# Altium schematic sheet Sheet3.SchDoc
size A3; Author: Van Hieu; Organization: BACH-KHOA-DK; SheetNumber: 2; SheetTotal: 6; Gmail: maivanhieu24042003@gmail.com
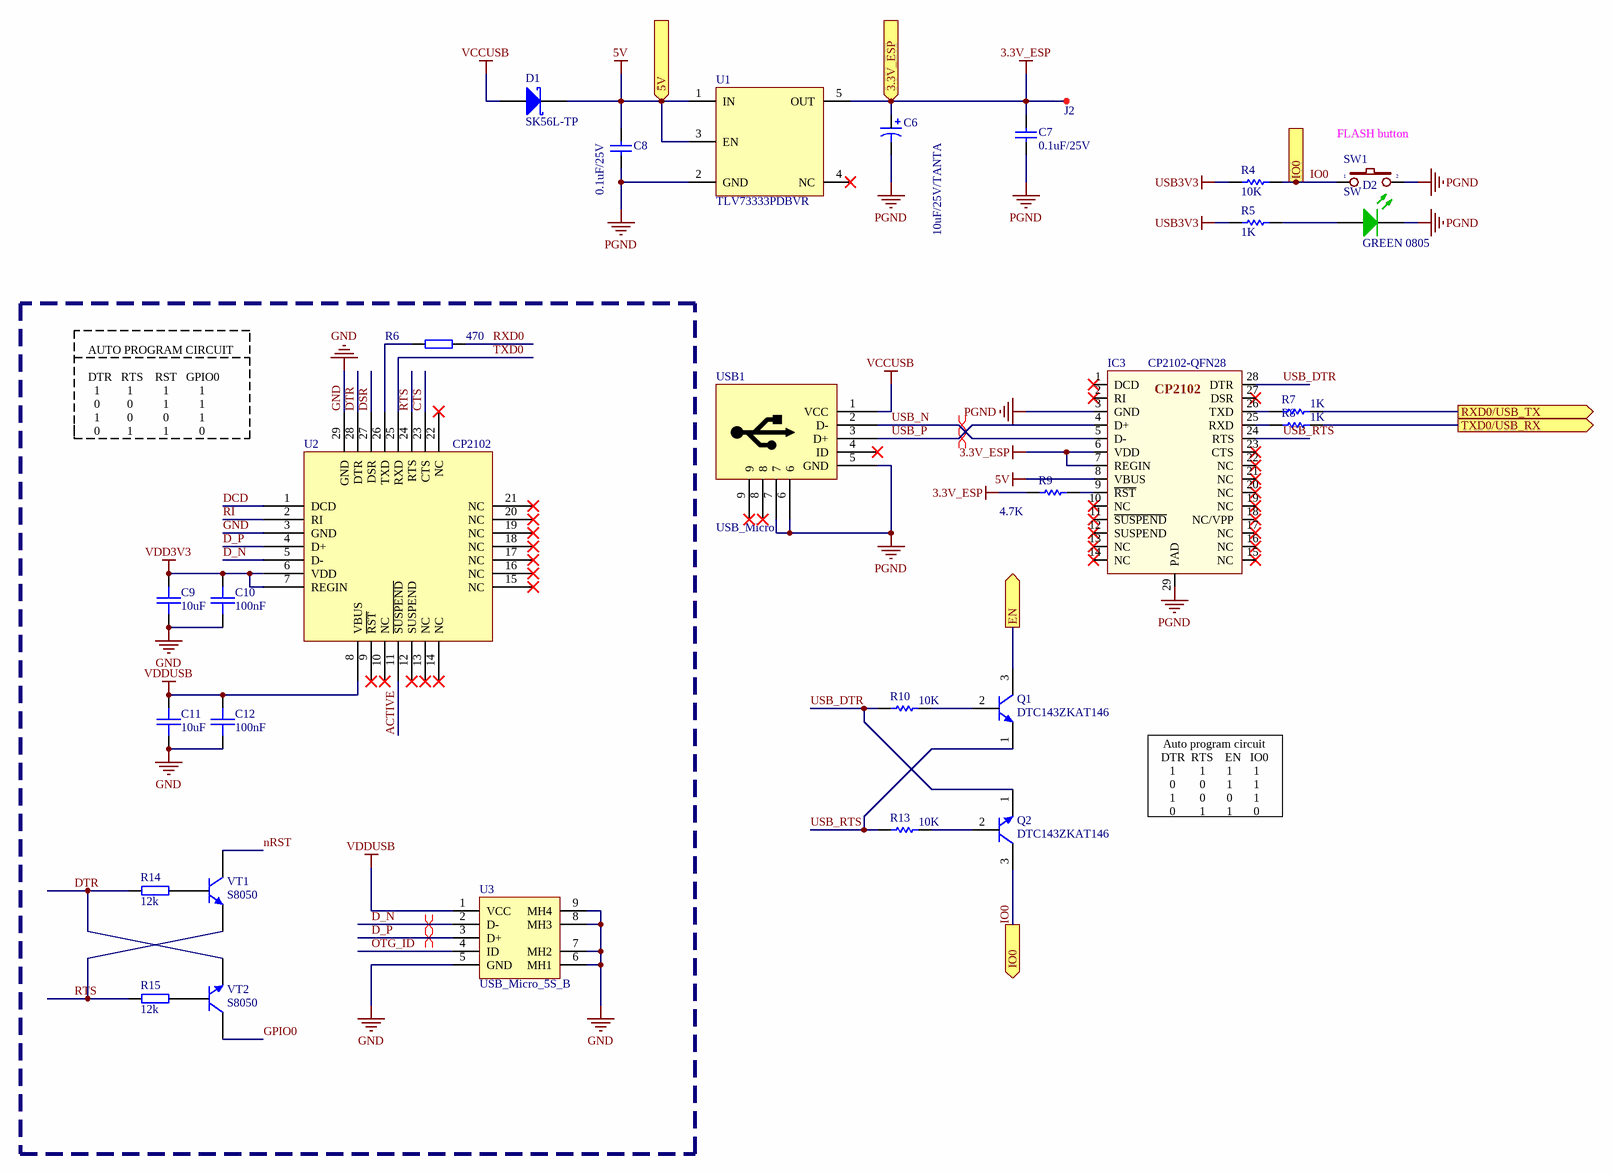
[diagram p0: Sheet3.SchDoc]

## Parts
C6  10uF/25V/TANTA  [CAP TANT CASE B SMD]
C7  0.1uF/25V  [CAP_CERA_C2012(CC0805INCH)]
C8  0.1uF/25V  [CAP_CERA_C2012(CC0805INCH)]
C9  10uF  [SMT_C_0402]
C10  100nF  [SMT_C_0402]
C11  10uF  [SMT_C_0402]
C12  100nF  [SMT_C_0402]
D1  SK56L-TP  [30# SK56L-TPMSCT-ND]
D2  GREEN 0805  [Led 0805G]
IC3  CP2102-QFN28  [CP2102]
J2  TEST POINT  [TEST POINT 1mm]  (value not drawn)
Q1  DTC143ZKAT146  [6# DTC143ZKAT146-E]
Q2  DTC143ZKAT146  [6# DTC143ZKAT146-E]
R4  10K  [Res 0805 SMD]
R5  1K  [Res 0805 SMD]
R6  470  [SMT_R_0402]
R7  1K  [Res 0805 SMD]
R8  1K  [Res 0805 SMD]
R9  4.7K  [Res 0805 SMD]
R10  10K  [Res 0805 SMD]
R13  10K  [Res 0805 SMD]
R14  12k  [SMT_R_0402]
R15  12k  [SMT_R_0402]
SW1  SW  [BUTTON 2PIN TRON]
U1  TLV73333PDBVR  [20# TLV73333PDBVR]
U2  CP2102  [CP2102]
U3  USB_Micro_5S_B  [USB_MICRO_5S_B]
USB1  USB_Micro  [USBMNIB]
VT1  S8050  [SMT_TRIODE_NPN]
VT2  S8050  [SMT_TRIODE_NPN]

## Ports
3.3V_ESP (in), 5V (in), EN (out), IO0 (out), RXD0/USB_TX (out), TXD0/USB_RX (out)

## Nets
3.3V_ESP: C6.1 C7.2 IC3.6(VDD) IC3.7(REGIN) J2.1(TP) R9.1 U1.5(OUT) ; port 3.3V_ESP
5V: C8.2 D1.2(K) IC3.8(VBUS) U1.1(IN) U1.3(EN) ; port 5V
GND: C9.2 C10.2 C11.2 C12.2 U2.3(GND) U2.29(GND) U3.5(GND) U3.6(MH1) U3.7(MH2) U3.8(MH3) U3.9(MH4)
PGND: C6.2 C7.1 C8.1 D2.2(K) IC3.3(GND) IC3.29(PAD) SW1.2 U1.2(GND) USB1.5(GND) USB1.6 USB1.7
USB3V3: R4.1 R5.1
VCCUSB: D1.1(A) USB1.1(VCC)
VDD3V3: C9.1 C10.1 U2.6(VDD) U2.7(REGIN)
VDDUSB: C11.1 C12.1 U2.8(VBUS) U3.1(VCC)
ACTIVE: U2.11(~{SUSPEND})
CTS: U2.23(CTS)
D_N: U2.5(D-) U3.2(D-)
D_P: U2.4(D+) U3.3(D+)
DCD: U2.1(DCD)
DSR: U2.27(DSR)
DTR: R14.2 U2.28(DTR) VT2.2(E)
EN: Q1.3(C) ; port EN
GPIO0: VT2.3(C)
IO0: Q2.3(C) R4.2 SW1.1 ; port IO0
nRST: VT1.3(C)
OTG_ID: U3.4(ID)
RI: U2.2(RI)
RTS: R15.2 U2.24(RTS) VT1.2(E)
RXD0: R6.2
RXD0/USB_TX: R7.1 ; port RXD0/USB_TX
TXD0: U2.25(RXD)
TXD0/USB_RX: R8.1 ; port TXD0/USB_RX
USB_DTR: IC3.28(DTR) Q2.1(E) R10.2
USB_N: IC3.5(D-) USB1.2(D-)
USB_P: IC3.4(D+) USB1.3(D+)
USB_RTS: IC3.24(RTS) Q1.1(E) R13.2
NetD2_1: D2.1(A) R5.2
NetIC3_9: IC3.9(~{RST}) R9.2
NetIC3_25: IC3.25(RXD) R8.2
NetIC3_26: IC3.26(TXD) R7.2
NetQ1_2: Q1.2(B) R10.1
NetQ2_2: Q2.2(B) R13.1
NetR6_1: R6.1 U2.26(TXD)
NetR14_1: R14.1 VT1.1(B)
NetR15_1: R15.1 VT2.1(B)

Not connected (* = marked no-connect by the designer): IC3 1(DCD)* 2(RI)* 10(NC)* 11(~{SUSPEND})* 12(SUSPEND)* 13(NC)* 14(NC)* 15(NC)* 16(NC)* 17(NC)* 18(NC/VPP)* 19(NC)* 20(NC)* 21(NC)* 22(NC)* 23(CTS)* 27(DSR)*; U1 4(NC)*; U2 9(~{RST})* 10(NC)* 12(SUSPEND)* 13(NC)* 14(NC)* 15(NC)* 16(NC)* 17(NC)* 18(NC)* 19(NC)* 20(NC)* 21(NC)* 22(NC)*; USB1 4(ID)* 8* 9*

## Layout directives
differential pair: D_N, D_P, USB_N, USB_P

## Notes on the sheet
- (near SW1) FLASH button
- AUTO PROGRAM CIRCUIT
  DTR   RTS    RST   GPIO0
  1         1          1          1
  0         0          1          1
  1         0          0          1
  0         1          1          0
- Auto program circuit
  DTR  RTS    EN   IO0
  1        1       1       1
  0        0       1       1
  1        0       0       1
  0        1       1       0
- Van Hieu
- Date:
- Size:
- A3
- Number:
- Time:
- Sheet
- Revision:
- of
- BK-DN
- File:
- maivanhieu24042003@gmail.com

## Library data of the parts
C6 = TAJB106M025RNJ: 10µF Molded Tantalum Capacitors 25V 1411 (3528 Metric) 3 Ohm; Manufacturer: KEMET; Digikey: 399-5125-1-ND
C7 = 0.1uF/50V/C0603/10%: 0.1µF ±10% 25V Ceramic Capacitor X7R 0805 (2012 Metric); Manufacturer: KEMET; ComponentLink1URL: http://www.murata.com/~/media/webrenewal/support/library/catalog/products/capacitor/mlcc/c02e.ashx; ComponentLink1Description: http://www.murata.com/~/media/webrenewal/support/library/catalog/products/capacitor/mlcc/c02e.ashx; Digikey: 478-3755-1-ND
C8 = 0.1uF/50V/C0603/10%: 0.1µF ±10% 25V Ceramic Capacitor X7R 0805 (2012 Metric); ComponentLink1URL: http://www.murata.com/~/media/webrenewal/support/library/catalog/products/capacitor/mlcc/c02e.ashx; ComponentLink1Description: http://www.murata.com/~/media/webrenewal/support/library/catalog/products/capacitor/mlcc/c02e.ashx; Digikey: 478-3755-1-ND
C9-C12 = SMT_C_0402: Surface mount capacitor 0402
D1 = 30# SK56L-TP: DIODE SCHOTTKY 60V 5A DO214AB; ComponentLink1URL: http://www.mccsemi.com/up_pdf/SK52L-SK510L(DO-214AB).PDF; ComponentLink1Description: http://www.mccsemi.com/up_pdf/SK52L-SK510L(DO-214AB).PDF; Digikey: SK56L-TPMSCT-ND
D2 = LED GREEN 0603: Green 571nm LED Indication - Discrete 2V 0805 (2012 Metric); ComponentLink1URL: http://optoelectronics.liteon.com/upload/download/DS22-2000-074/S_110_LTST-C190KGKT.pdf; ComponentLink1Description: http://optoelectronics.liteon.com/upload/download/DS22-2000-074/S_110_LTST-C190KGKT.pdf; Digikey: 160-1426-1-ND
IC3 = CP2102
J2 = PAD 1mm: TPoint
Q1 Q2 = 6#DTC143ZKAT146: Pre-Biased Bipolar Transistor (BJT) NPN - Pre-Biased 50V 100mA 250MHz 200mW Surface Mount SMT3; Digikey: DTC143ZKAT146CT-ND
R4 = 200K/R0603/1%: 10 kOhms ±1% 0.125W, 1/8W Chip Resistor 0805 (2012 Metric) Thick Film; Power (Watts): 0.1W, 1/10W; RoHS: RoHS Compliant; Category: Resistors; Part Status: Active; Features: Moisture Resistant; Operating Temperature: -55°C ~ 155°C; Package / Case: 0603 (1608 Metric); Supplier Device Package: 0603; Size / Dimension: 0.063" L x 0.031" W (1.60mm x 0.80mm); Height - Seated (Max): 0.022" (0.55mm); Failure Rate: -; ComponentLink1URL: http://www.yageo.com/documents/recent/PYu-RC_Group_51_RoHS_L_7.pdf; ComponentLink1Description: http://www.yageo.com/documents/recent/PYu-RC_Group_51_RoHS_L_7.pdf; Digikey: A126332CT-ND
R5 = 200K/R0603/1%: 1 kOhms ±1% 0.125W, 1/8W Chip Resistor 0805 (2012 Metric) Automotive AEC-Q200 Thick Film; Power (Watts): 0.1W, 1/10W; RoHS: RoHS Compliant; Category: Resistors; Part Status: Active; Features: Moisture Resistant; Operating Temperature: -55°C ~ 155°C; Package / Case: 0603 (1608 Metric); Supplier Device Package: 0603; Size / Dimension: 0.063" L x 0.031" W (1.60mm x 0.80mm); Height - Seated (Max): 0.022" (0.55mm); Failure Rate: -; ComponentLink1URL: http://www.yageo.com/documents/recent/PYu-RC_Group_51_RoHS_L_7.pdf; ComponentLink1Description: http://www.yageo.com/documents/recent/PYu-RC_Group_51_RoHS_L_7.pdf; Digikey: 541-1.00KCCT-ND
R6 R14 R15 = SMT_R_0402: Surface mount resistor 0402
R7 R8 = 34.8K/R0805/1%: 1 kOhms ±1% 0.125W, 1/8W Chip Resistor 0805 (2012 Metric) Automotive AEC-Q200 Thick Film; Power Rating: 100mW; Resistance: 34.8kR; Voltage Rating: 50V; Case/Package: 0603; Case Code (Imperial): 0603; Case Code (Metric): 1608; Min Operating Temperature: -55°C; Max Operating Temperature: 155°C; Termination: SMD/SMT; Military Standard: Not; Voltage Rating (DC): 50V; Length: 1.6mm; Height: 0.45mm; Width: 0.8mm; Depth: 0.8mm; Lead Free: Lead Free; Digikey: 541-1.00KCCT-ND
R9 = 34.8K/R0805/1%: 4.7 kOhms ±1% 0.125W, 1/8W Chip Resistor 0805 (2012 Metric) Thick Film; Digikey: 541-4131-1-ND
R10 R13 = 34.8K/R0805/1%: 10 kOhms ±1% 0.125W, 1/8W Chip Resistor 0805 (2012 Metric) Thick Film; Power Rating: 100mW; Resistance: 34.8kR; Voltage Rating: 50V; Case/Package: 0603; Case Code (Imperial): 0603; Case Code (Metric): 1608; Min Operating Temperature: -55°C; Max Operating Temperature: 155°C; Termination: SMD/SMT; Military Standard: Not; Voltage Rating (DC): 50V; Length: 1.6mm; Height: 0.45mm; Width: 0.8mm; Depth: 0.8mm; Lead Free: Lead Free; Digikey: A126332CT-ND
SW1 = SW2: Switch button 2 pin; Value: SW chip 2 pin
U1 = 20#TLV73333PDBVR: Linear Voltage Regulator IC Positive Fixed 1 Output 3.3V 300mA SOT-23-5; Digikey: 296-40673-1-ND
U3 = USB_Micro_5S_B: USB micro female SMT with 4 fixed foot
USB1 = USB_MINI
VT1 VT2 = SMT_TRIODE_NPN: Surface mount NPN transistor, package SOT-23